# EAGLE schematic Schematic (EAGLE 7.7.0)
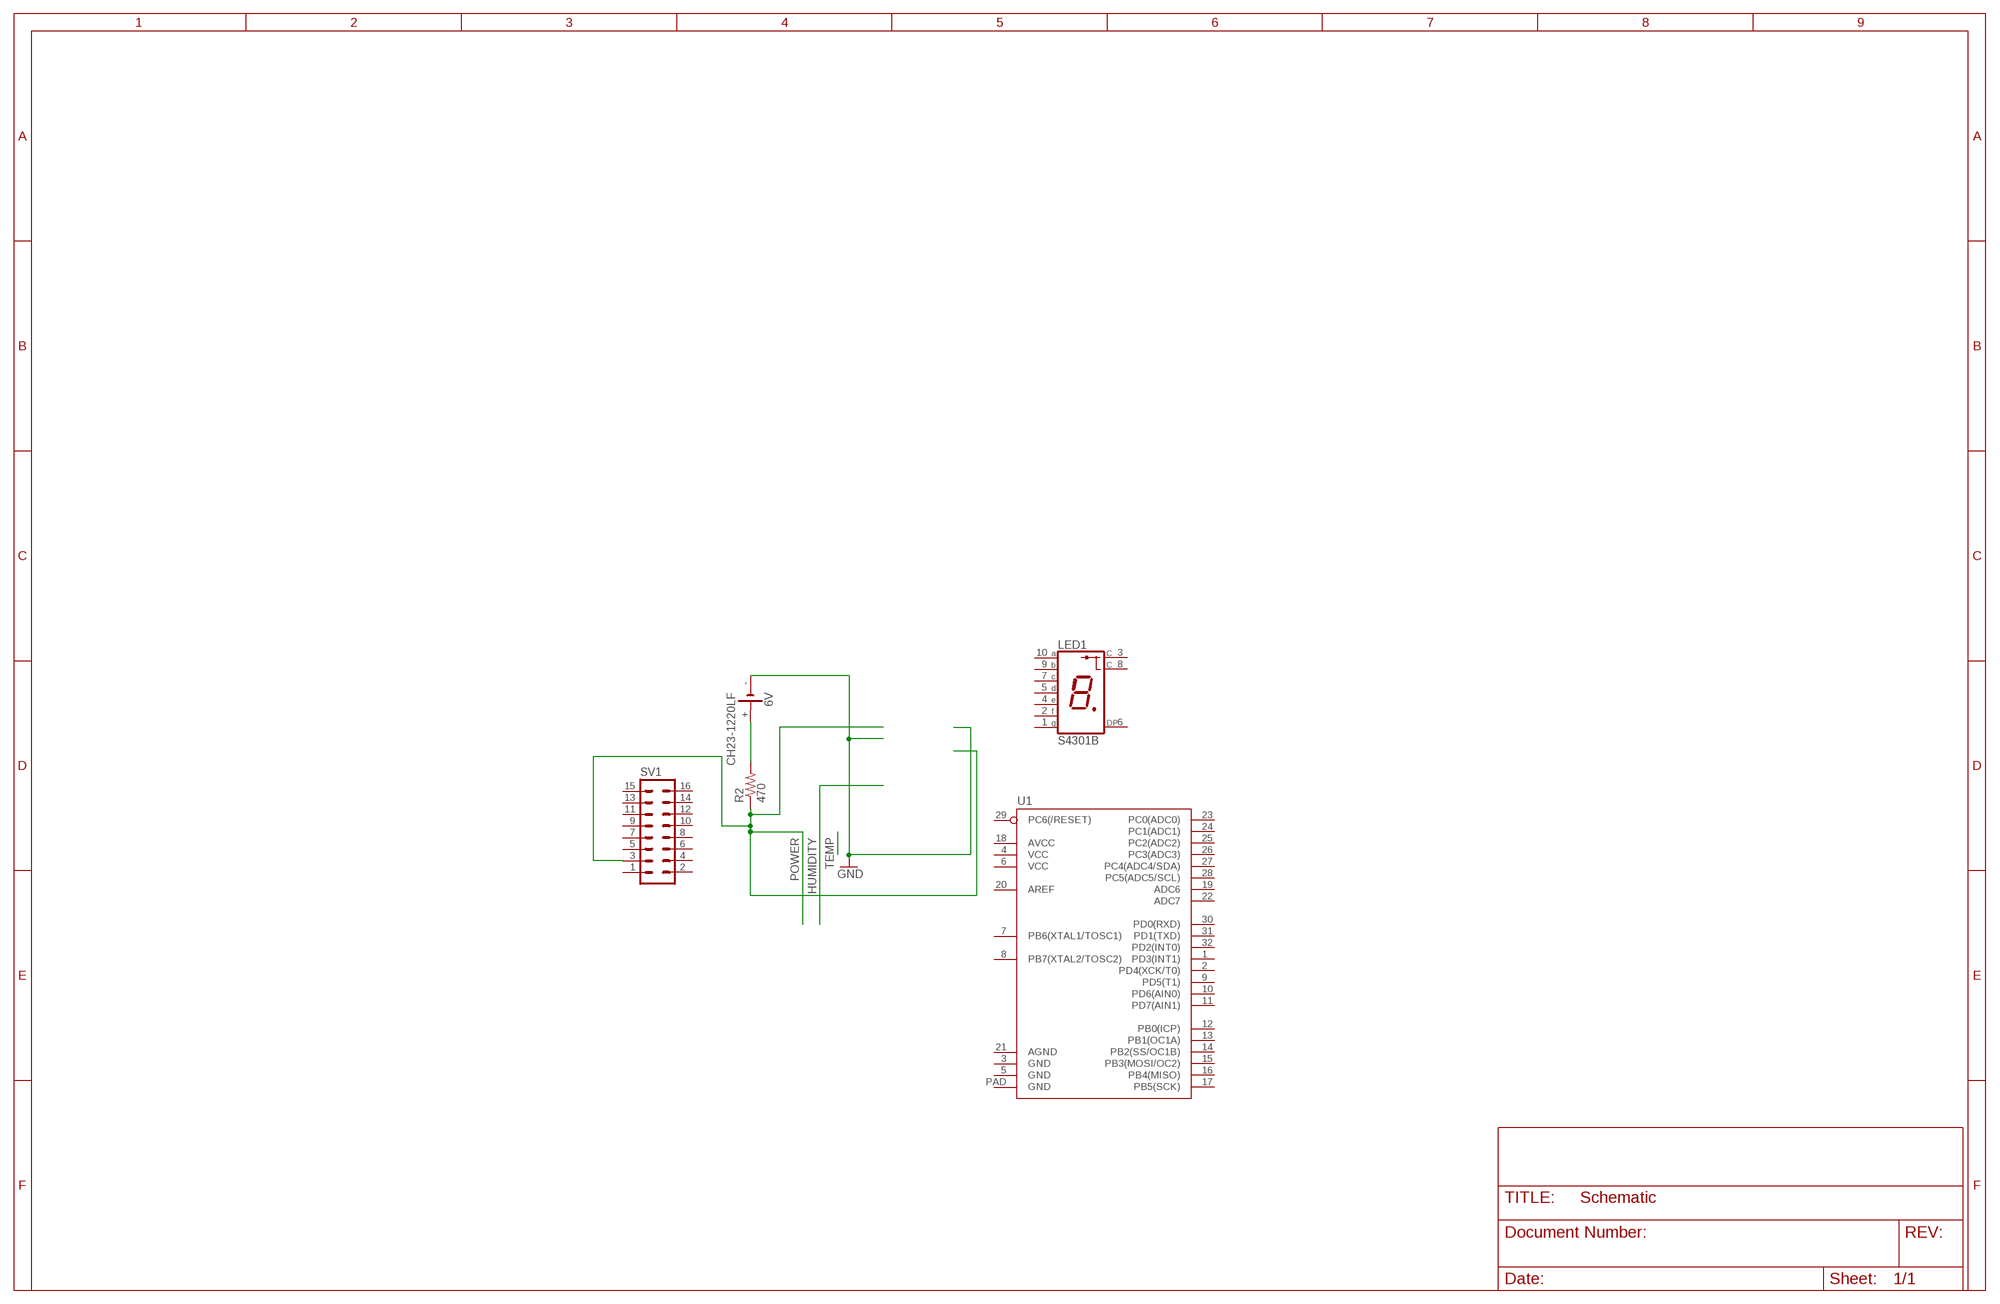
[diagram p0: schematic, sheet 1]

## Parts
6V  CH23-1220LF  [CH23-1220LF]
LED1  S4301B  [S4301B]
R2  470  R-US_0204/2V  [0204V]
SV1  16PL  [16PL]
U1  ATMEGA328P_MLFMLF32  [MLF32-PAD]

## Nets
GND: 6V.-
N$1: 6V.+ R2.2
POWER: R2.1 SV1.3
Unconnected: LED1.1(G) LED1.2(F) LED1.3(C) LED1.4(E) LED1.5(D) LED1.6(DP) LED1.7(C) LED1.8(C) LED1.9(B) LED1.10(A) SV1.1 SV1.2 SV1.4 SV1.5 SV1.6 SV1.7 SV1.8 SV1.9 SV1.10 SV1.11 SV1.12 SV1.13 SV1.14 SV1.15 SV1.16 U1.1(PD3(INT1)) U1.2(PD4(XCK/T0)) U1.3(GND) U1.4(VCC) U1.5(GND) U1.6(VCC) U1.7(PB6(XTAL1/TOSC1)) U1.8(PB7(XTAL2/TOSC2)) U1.9(PD5(T1)) U1.10(PD6(AIN0)) U1.11(PD7(AIN1)) U1.12(PB0(ICP)) U1.13(PB1(OC1A)) U1.14(PB2(SS/OC1B)) U1.15(PB3(MOSI/OC2)) U1.16(PB4(MISO)) U1.17(PB5(SCK)) U1.18(AVCC) U1.19(ADC6) U1.20(AREF) U1.21(AGND) U1.22(ADC7) U1.23(PC0(ADC0)) U1.24(PC1(ADC1)) U1.25(PC2(ADC2)) U1.26(PC3(ADC3)) U1.27(PC4(ADC4/SDA)) U1.28(PC5(ADC5/SCL)) U1.29(PC6(/RESET)) U1.30(PD0(RXD)) U1.31(PD1(TXD)) U1.32(PD2(INT0)) U1.PAD(GND)

## Library data of the parts
6V = battery:CH23-1220LF: Battary Holder, DIP, 12mm multicomp PART NO. CH-1220LF Source: Data sheet <http://www.farnell.com/datasheets/1505861.pdf>
LED1 = led-7-segment:S4301B: Single Digit Seven-Segment Display (cathode common) Source: LITEON .. S4301B.pdf; OC_FARNELL: unknown; OC_NEWARK: unknown
R2 = rcl:R-US_: RESISTOR, American symbol
SV1 = con-dil:16PL: DIL CABLE CONNECTOR
U1 = SparkFun-DigitalIC:ATMEGA328P_MLF: 32-Pin Atmega328 part Commonly used on Arduino compatible boards Available in QFP and QFN packages TQFP is IC-09069 QFN is non-stock